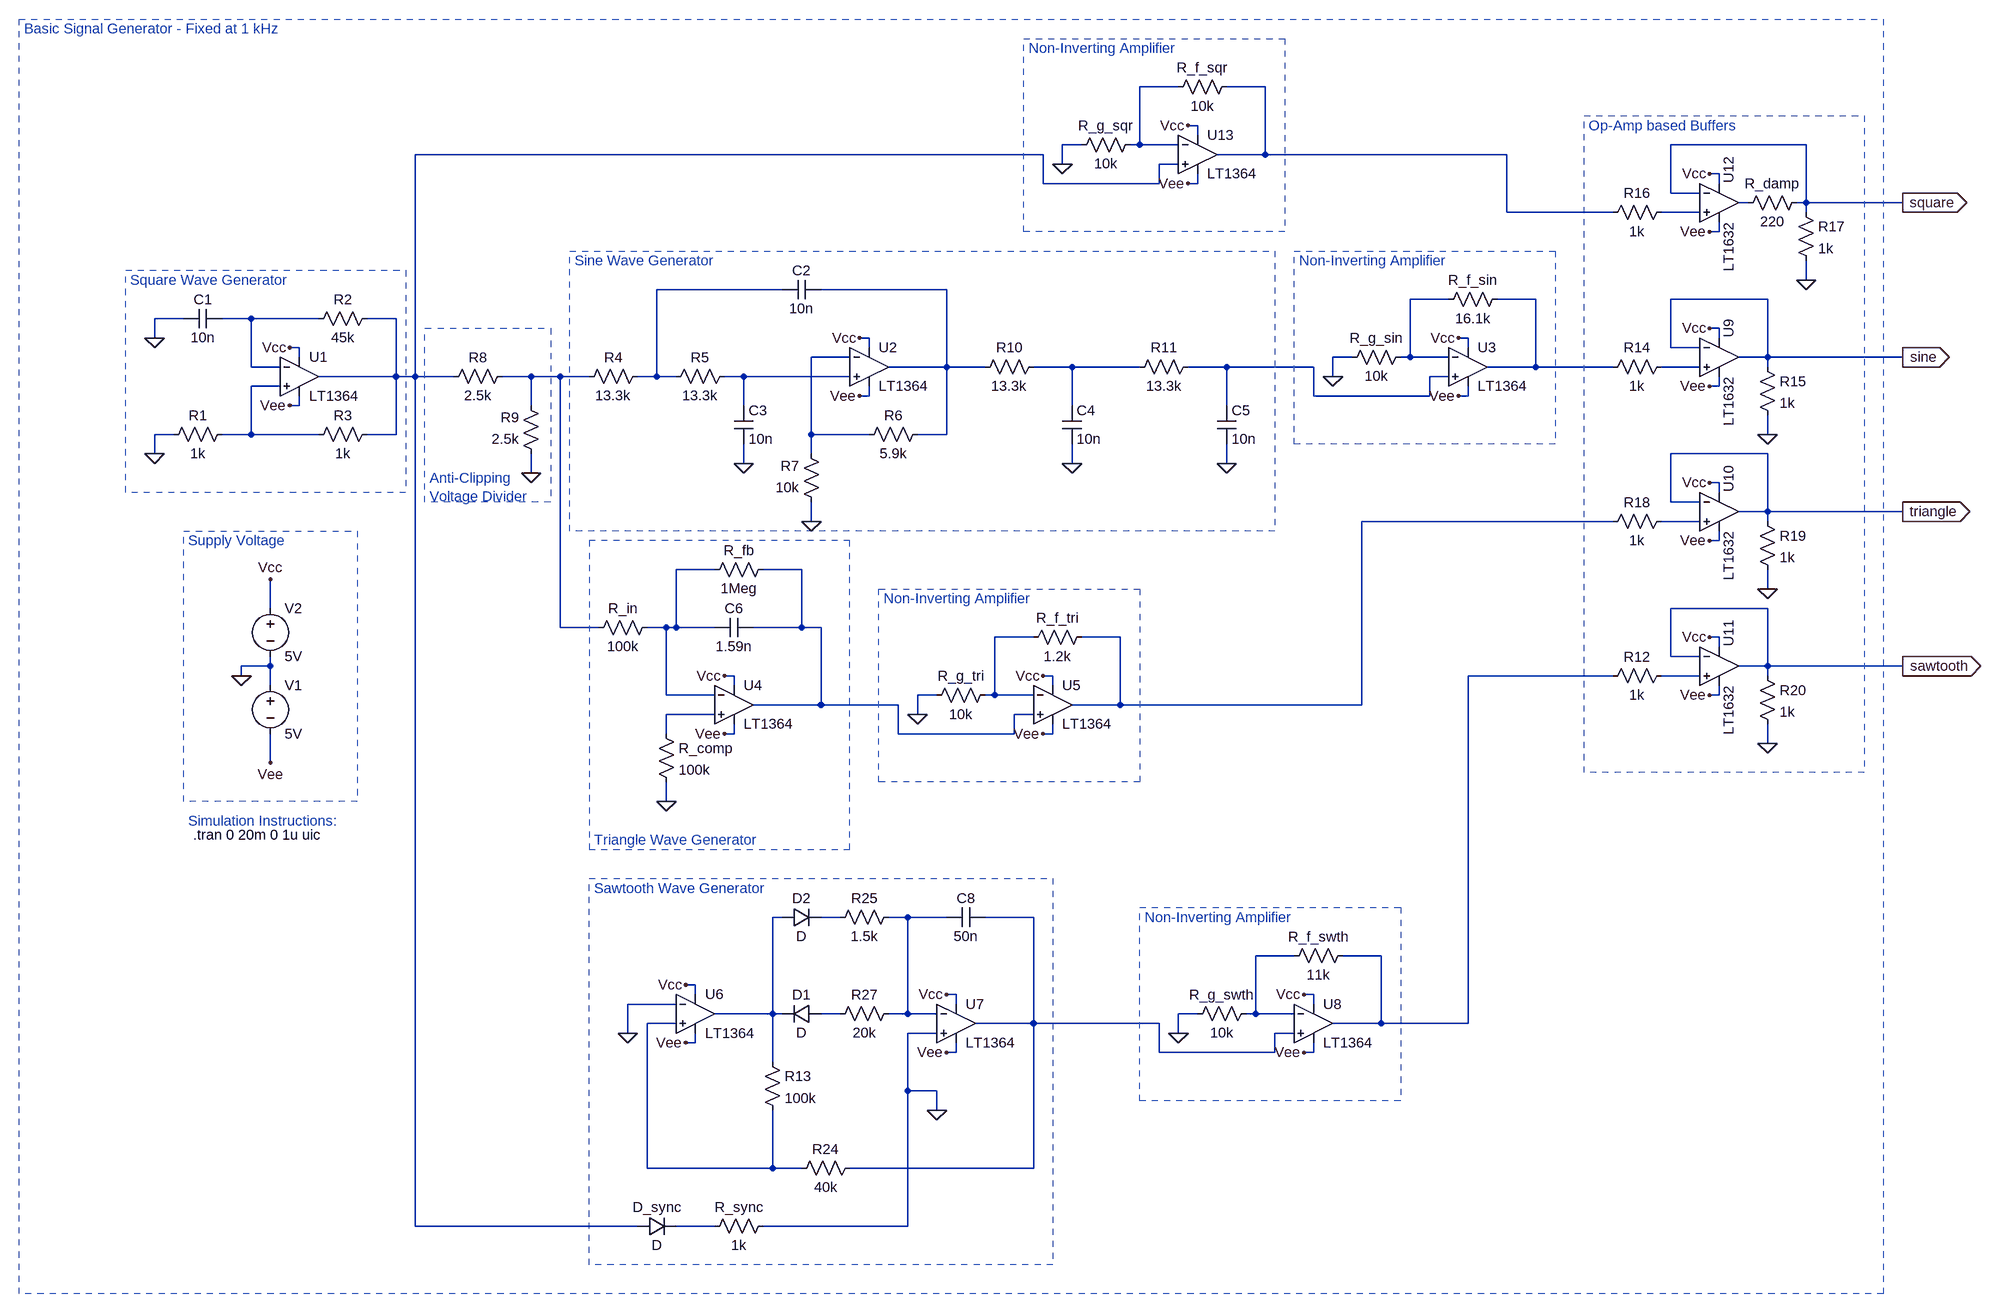
[diagram p0: schematic multi-wave-osc-lt1364.asc]
multi-wave-osc-lt1364.asc, the LTspice schematic file:
Version 4
SHEET 1 3052 2516
WIRE 1632 -176 1568 -176
WIRE 1776 -176 1712 -176
WIRE 1664 -112 1648 -112
WIRE 1664 -96 1664 -112
WIRE 1472 -80 1440 -80
WIRE 1568 -80 1568 -176
WIRE 1568 -80 1552 -80
WIRE 1632 -80 1568 -80
WIRE 2672 -80 2448 -80
WIRE 1408 -64 368 -64
WIRE 1776 -64 1776 -176
WIRE 1776 -64 1696 -64
WIRE 2176 -64 1776 -64
WIRE 1440 -48 1440 -80
WIRE 1632 -48 1600 -48
WIRE 2528 -32 2512 -32
WIRE 1408 -16 1408 -64
WIRE 1600 -16 1600 -48
WIRE 1600 -16 1408 -16
WIRE 1664 -16 1664 -32
WIRE 1664 -16 1648 -16
WIRE 2528 -16 2528 -32
WIRE 2448 0 2448 -80
WIRE 2496 0 2448 0
WIRE 2576 16 2560 16
WIRE 2672 16 2672 -80
WIRE 2672 16 2656 16
WIRE 2832 16 2672 16
WIRE 2176 32 2176 -64
WIRE 2352 32 2176 32
WIRE 2496 32 2432 32
WIRE 2672 32 2672 16
WIRE 2528 64 2528 48
WIRE 2528 64 2512 64
WIRE 2672 144 2672 112
WIRE 976 160 768 160
WIRE 1248 160 1040 160
WIRE 2080 176 2016 176
WIRE 2224 176 2160 176
WIRE 2608 176 2448 176
WIRE -16 208 -64 208
WIRE 96 208 48 208
WIRE 208 208 96 208
WIRE 336 208 288 208
WIRE 2528 224 2512 224
WIRE -64 240 -64 208
WIRE 1120 240 1104 240
WIRE 2112 240 2096 240
WIRE 2528 240 2528 224
WIRE 176 256 160 256
WIRE 1120 256 1120 240
WIRE 2112 256 2112 240
WIRE 2448 256 2448 176
WIRE 2496 256 2448 256
WIRE 176 272 176 256
WIRE 1088 272 1024 272
WIRE 1920 272 1888 272
WIRE 2016 272 2016 176
WIRE 2016 272 2000 272
WIRE 2080 272 2016 272
WIRE 2608 272 2608 176
WIRE 2608 272 2560 272
WIRE 2832 272 2608 272
WIRE 96 288 96 208
WIRE 144 288 96 288
WIRE 1248 288 1248 160
WIRE 1248 288 1152 288
WIRE 1312 288 1248 288
WIRE 1456 288 1392 288
WIRE 1568 288 1456 288
WIRE 1712 288 1648 288
WIRE 1856 288 1712 288
WIRE 2224 288 2224 176
WIRE 2224 288 2144 288
WIRE 2352 288 2224 288
WIRE 2496 288 2432 288
WIRE 2608 288 2608 272
WIRE 336 304 336 208
WIRE 336 304 208 304
WIRE 368 304 368 -64
WIRE 368 304 336 304
WIRE 432 304 368 304
WIRE 560 304 512 304
WIRE 608 304 560 304
WIRE 656 304 608 304
WIRE 768 304 768 160
WIRE 768 304 736 304
WIRE 800 304 768 304
WIRE 912 304 880 304
WIRE 1088 304 912 304
WIRE 1888 304 1888 272
WIRE 2080 304 2048 304
WIRE 144 320 96 320
WIRE 2528 320 2528 304
WIRE 2528 320 2512 320
WIRE 1120 336 1120 320
WIRE 1120 336 1104 336
WIRE 1856 336 1856 288
WIRE 2048 336 2048 304
WIRE 2048 336 1856 336
WIRE 2112 336 2112 320
WIRE 2112 336 2096 336
WIRE 176 352 176 336
WIRE 176 352 160 352
WIRE 560 352 560 304
WIRE 912 352 912 304
WIRE 1456 352 1456 288
WIRE 1712 352 1712 288
WIRE -32 400 -64 400
WIRE 96 400 96 320
WIRE 96 400 48 400
WIRE 208 400 96 400
WIRE 336 400 336 304
WIRE 336 400 288 400
WIRE 1024 400 1024 272
WIRE 1120 400 1024 400
WIRE 1248 400 1248 288
WIRE 1248 400 1200 400
WIRE 2608 400 2608 368
WIRE -64 432 -64 400
WIRE 1024 432 1024 400
WIRE 2608 432 2448 432
WIRE 912 448 912 416
WIRE 1456 448 1456 416
WIRE 1712 448 1712 416
WIRE 560 464 560 432
WIRE 2528 480 2512 480
WIRE 2528 496 2528 480
WIRE 2448 512 2448 432
WIRE 2496 512 2448 512
WIRE 2608 528 2608 432
WIRE 2608 528 2560 528
WIRE 2832 528 2608 528
WIRE 1024 544 1024 512
WIRE 2352 544 1936 544
WIRE 2496 544 2432 544
WIRE 2608 544 2608 528
WIRE 2528 576 2528 560
WIRE 2528 576 2512 576
WIRE 864 624 800 624
WIRE 1008 624 944 624
WIRE 2608 656 2608 624
WIRE 128 688 128 640
WIRE 2608 688 2448 688
WIRE 608 720 608 304
WIRE 672 720 608 720
WIRE 784 720 752 720
WIRE 800 720 800 624
WIRE 800 720 784 720
WIRE 864 720 800 720
WIRE 1008 720 1008 624
WIRE 1008 720 928 720
WIRE 1040 720 1008 720
WIRE 1392 736 1328 736
WIRE 1536 736 1472 736
WIRE 2528 736 2512 736
WIRE 2528 752 2528 736
WIRE 2448 768 2448 688
WIRE 2496 768 2448 768
WIRE 128 784 128 768
WIRE 128 784 80 784
WIRE 2608 784 2608 688
WIRE 2608 784 2560 784
WIRE 2832 784 2608 784
WIRE 80 800 80 784
WIRE 896 800 880 800
WIRE 1424 800 1408 800
WIRE 2352 800 2112 800
WIRE 2496 800 2432 800
WIRE 2608 800 2608 784
WIRE 128 816 128 784
WIRE 896 816 896 800
WIRE 1424 816 1424 800
WIRE 784 832 784 720
WIRE 864 832 784 832
WIRE 1232 832 1200 832
WIRE 1328 832 1328 736
WIRE 1328 832 1312 832
WIRE 1392 832 1328 832
WIRE 2528 832 2528 816
WIRE 2528 832 2512 832
WIRE 1040 848 1040 720
WIRE 1040 848 928 848
WIRE 1168 848 1040 848
WIRE 1536 848 1536 736
WIRE 1536 848 1456 848
WIRE 1936 848 1936 544
WIRE 1936 848 1536 848
WIRE 864 864 784 864
WIRE 1200 864 1200 832
WIRE 1392 864 1360 864
WIRE 784 896 784 864
WIRE 896 896 896 880
WIRE 896 896 880 896
WIRE 1168 896 1168 848
WIRE 1360 896 1360 864
WIRE 1360 896 1168 896
WIRE 1424 896 1424 880
WIRE 1424 896 1408 896
WIRE 2608 912 2608 880
WIRE 128 944 128 896
WIRE 784 1008 784 976
WIRE 976 1200 960 1200
WIRE 1072 1200 1040 1200
WIRE 1184 1200 1152 1200
WIRE 1248 1200 1184 1200
WIRE 1392 1200 1312 1200
WIRE 1824 1264 1760 1264
WIRE 1968 1264 1904 1264
WIRE 832 1312 816 1312
WIRE 832 1328 832 1312
WIRE 1264 1328 1248 1328
WIRE 1856 1328 1840 1328
WIRE 800 1344 720 1344
WIRE 1264 1344 1264 1328
WIRE 1856 1344 1856 1328
WIRE 960 1360 960 1200
WIRE 960 1360 864 1360
WIRE 976 1360 960 1360
WIRE 1072 1360 1040 1360
WIRE 1184 1360 1184 1200
WIRE 1184 1360 1152 1360
WIRE 1232 1360 1184 1360
WIRE 1664 1360 1632 1360
WIRE 1760 1360 1760 1264
WIRE 1760 1360 1744 1360
WIRE 1824 1360 1760 1360
WIRE 800 1376 752 1376
WIRE 1392 1376 1392 1200
WIRE 1392 1376 1296 1376
WIRE 1600 1376 1392 1376
WIRE 1968 1376 1968 1264
WIRE 1968 1376 1888 1376
WIRE 2112 1376 2112 800
WIRE 2112 1376 1968 1376
WIRE 720 1392 720 1344
WIRE 1232 1392 1184 1392
WIRE 1632 1392 1632 1360
WIRE 1824 1392 1792 1392
WIRE 832 1408 832 1392
WIRE 832 1408 816 1408
WIRE 1264 1424 1264 1408
WIRE 1264 1424 1248 1424
WIRE 1600 1424 1600 1376
WIRE 1792 1424 1792 1392
WIRE 1792 1424 1600 1424
WIRE 1856 1424 1856 1408
WIRE 1856 1424 1840 1424
WIRE 960 1440 960 1360
WIRE 1184 1488 1184 1392
WIRE 1232 1488 1184 1488
WIRE 1232 1520 1232 1488
WIRE 752 1616 752 1376
WIRE 960 1616 960 1520
WIRE 960 1616 752 1616
WIRE 1008 1616 960 1616
WIRE 1392 1616 1392 1376
WIRE 1392 1616 1088 1616
WIRE 368 1712 368 304
WIRE 736 1712 368 1712
WIRE 864 1712 800 1712
WIRE 1184 1712 1184 1488
WIRE 1184 1712 944 1712
FLAG -64 240 0
FLAG -64 432 0
FLAG 80 800 0
FLAG 2832 16 square
IOPIN 2832 16 Out
FLAG 128 640 Vcc
FLAG 128 944 Vee
FLAG 160 256 Vcc
FLAG 160 352 Vee
FLAG 1104 240 Vcc
FLAG 1104 336 Vee
FLAG 1024 544 0
FLAG 912 448 0
FLAG 2832 272 sine
IOPIN 2832 272 Out
FLAG 560 464 0
FLAG 1456 448 0
FLAG 1712 448 0
FLAG 2832 528 triangle
IOPIN 2832 528 Out
FLAG 880 800 Vcc
FLAG 880 896 Vee
FLAG 2512 224 Vcc
FLAG 2512 320 Vee
FLAG 2608 400 0
FLAG 2512 -32 Vcc
FLAG 2512 64 Vee
FLAG 2672 144 0
FLAG 2512 480 Vcc
FLAG 2512 576 Vee
FLAG 2608 656 0
FLAG 2096 240 Vcc
FLAG 2096 336 Vee
FLAG 1888 304 0
FLAG 784 1008 0
FLAG 1408 800 Vcc
FLAG 1408 896 Vee
FLAG 1200 864 0
FLAG 816 1312 Vcc
FLAG 816 1408 Vee
FLAG 1248 1328 Vcc
FLAG 1248 1424 Vee
FLAG 2512 736 Vcc
FLAG 2512 832 Vee
FLAG 2608 912 0
FLAG 2832 784 sawtooth
IOPIN 2832 784 Out
FLAG 1840 1328 Vcc
FLAG 1840 1424 Vee
FLAG 1632 1392 0
FLAG 720 1392 0
FLAG 1232 1520 0
FLAG 1648 -112 Vcc
FLAG 1648 -16 Vee
FLAG 1440 -48 0
SYMBOL cap 48 192 R90
WINDOW 0 0 32 VBottom 2
WINDOW 3 32 32 VTop 2
SYMATTR InstName C1
SYMATTR Value 10n
SYMBOL res 64 384 R90
WINDOW 0 0 56 VBottom 2
WINDOW 3 32 56 VTop 2
SYMATTR InstName R1
SYMATTR Value 1k
SYMBOL res 304 192 R90
WINDOW 0 0 56 VBottom 2
WINDOW 3 32 56 VTop 2
SYMATTR InstName R2
SYMATTR Value 45k
SYMBOL res 304 384 R90
WINDOW 0 0 56 VBottom 2
WINDOW 3 32 56 VTop 2
SYMATTR InstName R3
SYMATTR Value 1k
SYMBOL voltage 128 800 R0
WINDOW 123 0 0 Left 0
WINDOW 39 0 0 Left 0
SYMATTR InstName V1
SYMATTR Value 5V
SYMBOL voltage 128 672 R0
WINDOW 123 0 0 Left 0
WINDOW 39 0 0 Left 0
SYMATTR InstName V2
SYMATTR Value 5V
SYMBOL res 1216 384 R90
WINDOW 0 0 56 VBottom 2
WINDOW 3 32 56 VTop 2
SYMATTR InstName R6
SYMATTR Value 5.9k
SYMBOL res 1040 528 R180
WINDOW 0 36 76 Left 2
WINDOW 3 36 40 Left 2
SYMATTR InstName R7
SYMATTR Value 10k
SYMBOL cap 1040 144 R90
WINDOW 0 0 32 VBottom 2
WINDOW 3 32 32 VTop 2
SYMATTR InstName C2
SYMATTR Value 10n
SYMBOL cap 896 352 R0
SYMATTR InstName C3
SYMATTR Value 10n
SYMBOL res 896 288 R90
WINDOW 0 0 56 VBottom 2
WINDOW 3 32 56 VTop 2
SYMATTR InstName R5
SYMATTR Value 13.3k
SYMBOL res 752 288 R90
WINDOW 0 0 56 VBottom 2
WINDOW 3 32 56 VTop 2
SYMATTR InstName R4
SYMATTR Value 13.3k
SYMBOL res 528 288 R90
WINDOW 0 0 56 VBottom 2
WINDOW 3 32 56 VTop 2
SYMATTR InstName R8
SYMATTR Value 2.5k
SYMBOL res 576 448 R180
WINDOW 0 36 76 Left 2
WINDOW 3 36 40 Left 2
SYMATTR InstName R9
SYMATTR Value 2.5k
SYMBOL res 1408 272 R90
WINDOW 0 0 56 VBottom 2
WINDOW 3 32 56 VTop 2
SYMATTR InstName R10
SYMATTR Value 13.3k
SYMBOL cap 1440 352 R0
SYMATTR InstName C4
SYMATTR Value 10n
SYMBOL res 1664 272 R90
WINDOW 0 0 56 VBottom 2
WINDOW 3 32 56 VTop 2
SYMATTR InstName R11
SYMATTR Value 13.3k
SYMBOL cap 1696 352 R0
SYMATTR InstName C5
SYMATTR Value 10n
SYMBOL res 768 704 R90
WINDOW 0 0 56 VBottom 2
WINDOW 3 32 56 VTop 2
SYMATTR InstName R_in
SYMATTR Value 100k
SYMBOL cap 928 704 R90
WINDOW 0 0 32 VBottom 2
WINDOW 3 32 32 VTop 2
SYMATTR InstName C6
SYMATTR Value 1.59n
SYMBOL res 960 608 R90
WINDOW 0 0 56 VBottom 2
WINDOW 3 32 56 VTop 2
SYMATTR InstName R_fb
SYMATTR Value 1Meg
SYMBOL res 2448 272 R90
WINDOW 0 0 56 VBottom 2
WINDOW 3 32 56 VTop 2
SYMATTR InstName R14
SYMATTR Value 1k
SYMBOL res 2592 272 R0
SYMATTR InstName R15
SYMATTR Value 1k
SYMBOL res 2448 16 R90
WINDOW 0 0 56 VBottom 2
WINDOW 3 32 56 VTop 2
SYMATTR InstName R16
SYMATTR Value 1k
SYMBOL res 2656 16 R0
SYMATTR InstName R17
SYMATTR Value 1k
SYMBOL res 2448 528 R90
WINDOW 0 0 56 VBottom 2
WINDOW 3 32 56 VTop 2
SYMATTR InstName R18
SYMATTR Value 1k
SYMBOL res 2592 528 R0
SYMATTR InstName R19
SYMATTR Value 1k
SYMBOL res 2176 160 R90
WINDOW 0 0 56 VBottom 2
WINDOW 3 32 56 VTop 2
SYMATTR InstName R_f_sin
SYMATTR Value 16.1k
SYMBOL res 2016 256 R90
WINDOW 0 0 56 VBottom 2
WINDOW 3 32 56 VTop 2
SYMATTR InstName R_g_sin
SYMATTR Value 10k
SYMBOL res 768 880 R0
SYMATTR InstName R_comp
SYMATTR Value 100k
SYMBOL res 1488 720 R90
WINDOW 0 0 56 VBottom 2
WINDOW 3 32 56 VTop 2
SYMATTR InstName R_f_tri
SYMATTR Value 1.2k
SYMBOL res 1328 816 R90
WINDOW 0 0 56 VBottom 2
WINDOW 3 32 56 VTop 2
SYMATTR InstName R_g_tri
SYMATTR Value 10k
SYMBOL diode 1040 1344 R90
WINDOW 0 0 32 VBottom 2
WINDOW 3 32 32 VTop 2
SYMATTR InstName D1
SYMBOL diode 976 1216 R270
WINDOW 0 32 32 VTop 2
WINDOW 3 0 32 VBottom 2
SYMATTR InstName D2
SYMBOL res 1168 1184 R90
WINDOW 0 0 56 VBottom 2
WINDOW 3 32 56 VTop 2
SYMATTR InstName R25
SYMATTR Value 1.5k
SYMBOL res 1168 1344 R90
WINDOW 0 0 56 VBottom 2
WINDOW 3 32 56 VTop 2
SYMATTR InstName R27
SYMATTR Value 20k
SYMBOL cap 1312 1184 R90
WINDOW 0 0 32 VBottom 2
WINDOW 3 32 32 VTop 2
SYMATTR InstName C8
SYMATTR Value 50n
SYMBOL res 944 1424 R0
SYMATTR InstName R13
SYMATTR Value 100k
SYMBOL res 1104 1600 R90
WINDOW 0 0 56 VBottom 2
WINDOW 3 32 56 VTop 2
SYMATTR InstName R24
SYMATTR Value 40k
SYMBOL res 2448 784 R90
WINDOW 0 0 56 VBottom 2
WINDOW 3 32 56 VTop 2
SYMATTR InstName R12
SYMATTR Value 1k
SYMBOL res 2592 784 R0
SYMATTR InstName R20
SYMATTR Value 1k
SYMBOL res 1920 1248 R90
WINDOW 0 0 56 VBottom 2
WINDOW 3 32 56 VTop 2
SYMATTR InstName R_f_swth
SYMATTR Value 11k
SYMBOL res 1760 1344 R90
WINDOW 0 0 56 VBottom 2
WINDOW 3 32 56 VTop 2
SYMATTR InstName R_g_swth
SYMATTR Value 10k
SYMBOL res 960 1696 R90
WINDOW 0 0 56 VBottom 2
WINDOW 3 32 56 VTop 2
SYMATTR InstName R_sync
SYMATTR Value 1k
SYMBOL diode 736 1728 R270
WINDOW 0 32 32 VTop 2
WINDOW 3 0 32 VBottom 2
SYMATTR InstName D_sync
SYMBOL OpAmps\\LT1364 1120 224 R0
SYMATTR InstName U2
SYMBOL OpAmps\\LT1364 2112 224 R0
SYMATTR InstName U3
SYMBOL OpAmps\\LT1364 896 784 R0
SYMATTR InstName U4
SYMBOL OpAmps\\LT1364 1424 784 R0
SYMATTR InstName U5
SYMBOL OpAmps\\LT1364 832 1296 R0
SYMATTR InstName U6
SYMBOL OpAmps\\LT1364 1264 1312 R0
SYMATTR InstName U7
SYMBOL OpAmps\\LT1364 1856 1312 R0
SYMATTR InstName U8
SYMBOL OpAmps\\LT1364 176 240 R0
SYMATTR InstName U1
SYMBOL res 1728 -192 R90
WINDOW 0 0 56 VBottom 2
WINDOW 3 32 56 VTop 2
SYMATTR InstName R_f_sqr
SYMATTR Value 10k
SYMBOL res 1568 -96 R90
WINDOW 0 0 56 VBottom 2
WINDOW 3 32 56 VTop 2
SYMATTR InstName R_g_sqr
SYMATTR Value 10k
SYMBOL OpAmps\\LT1364 1664 -128 R0
SYMATTR InstName U13
SYMBOL res 2672 0 R90
WINDOW 0 0 56 VBottom 2
WINDOW 3 32 56 VTop 2
SYMATTR InstName R_damp
SYMATTR Value 220
SYMBOL OpAmps\\LT1632 2528 -48 R0
WINDOW 0 16 32 VLeft 2
WINDOW 3 16 96 VRight 2
SYMATTR InstName U12
SYMBOL OpAmps\\LT1632 2528 208 R0
WINDOW 0 16 32 VLeft 2
WINDOW 3 16 96 VRight 2
SYMATTR InstName U9
SYMBOL OpAmps\\LT1632 2528 464 R0
WINDOW 0 16 32 VLeft 2
WINDOW 3 16 96 VRight 2
SYMATTR InstName U10
SYMBOL OpAmps\\LT1632 2528 720 R0
WINDOW 0 16 32 VLeft 2
WINDOW 3 16 96 VRight 2
SYMATTR InstName U11
TEXT 0 1064 Left 2 !.tran 0 20m 0 1u uic
TEXT -104 144 Left 2 ;Square Wave Generator
TEXT 632 112 Left 2 ;Sine Wave Generator
TEXT 664 1072 Left 2 ;Triangle Wave Generator
TEXT 2312 -112 Left 2 ;Op-Amp based Buffers
TEXT 392 472 Left 2 ;Anti-Clipping \nVoltage Divider
TEXT 1832 112 Left 2 ;Non-Inverting Amplifier
TEXT 1144 672 Left 2 ;Non-Inverting Amplifier
TEXT 1576 1200 Left 2 ;Non-Inverting Amplifier
TEXT 664 1152 Left 2 ;Sawtooth Wave Generator
TEXT -280 -272 Left 2 ;Basic Signal Generator - Fixed at 1 kHz
TEXT -8 576 Left 2 ;Supply Voltage
TEXT -8 1040 Left 2 ;Simulation Instructions:
TEXT 1384 -240 Left 2 ;Non-Inverting Amplifier
RECTANGLE Normal 352 496 -112 128 2
RECTANGLE Normal 2256 416 1824 96 2
RECTANGLE Normal 656 1088 1088 576 2
RECTANGLE Normal 1568 976 1136 656 2
RECTANGLE Normal 2768 960 2304 -128 2
RECTANGLE Normal 2000 1504 1568 1184 2
RECTANGLE Normal 272 1008 -16 560 2
RECTANGLE Normal 1792 560 624 96 2
RECTANGLE Normal 592 512 384 224 2
RECTANGLE Normal 1424 1776 656 1136 2
RECTANGLE Normal 1808 64 1376 -256 2
RECTANGLE Normal 2800 1824 -288 -288 2

The netlist it stands for:
* multi-wave-osc-lt1364.asc
C1 N010 0 10n
R1 N017 0 1k
R2 N003 N010 45k
R3 N003 N017 1k
V1 0 Vee 5V
V2 Vcc 0 5V
R6 N007 N011 5.9k
R7 0 N011 10k
C2 N007 N006 10n
C3 N016 0 10n
R5 N016 N006 13.3k
R4 N006 N015 13.3k
R8 N015 N003 2.5k
R9 0 N015 2.5k
R10 N012 N007 13.3k
C4 N012 0 10n
R11 N013 N012 13.3k
C5 N013 0 10n
R_in N020 N015 100k
C6 N021 N020 1.59n
R_fb N021 N020 1Meg
R14 N014 N009 1k
R15 sine 0 1k
R16 N005 N002 1k
R17 square 0 1k
R18 N019 N018 1k
R19 triangle 0 1k
R_f_sin N009 N008 16.1k
R_g_sin N008 0 10k
R_comp N025 0 100k
R_f_tri N018 N022 1.2k
R_g_tri N022 0 10k
D1 N031 N026 D
D2 N026 N027 D
R25 N028 N027 1.5k
R27 N028 N031 20k
C8 N029 N028 50n
R13 N026 N032 100k
R24 N029 N032 40k
R12 N024 N023 1k
R20 sawtooth 0 1k
R_f_swth N023 N030 11k
R_g_swth N030 0 10k
R_sync 0 N033 1k
D_sync N003 N033 D
XU2 N016 N011 Vcc Vee N007 LT1363  ; LT1364, pins In+ In- V+ V- OUT
XU3 N013 N008 Vcc Vee N009 LT1363  ; LT1364, pins In+ In- V+ V- OUT
XU4 N025 N020 Vcc Vee N021 LT1363  ; LT1364, pins In+ In- V+ V- OUT
XU5 N021 N022 Vcc Vee N018 LT1363  ; LT1364, pins In+ In- V+ V- OUT
XU6 N032 0 Vcc Vee N026 LT1363  ; LT1364, pins In+ In- V+ V- OUT
XU7 0 N028 Vcc Vee N029 LT1363  ; LT1364, pins In+ In- V+ V- OUT
XU8 N029 N030 Vcc Vee N023 LT1363  ; LT1364, pins In+ In- V+ V- OUT
XU1 N017 N010 Vcc Vee N003 LT1363  ; LT1364, pins In+ In- V+ V- OUT
R_f_sqr N002 N001 10k
R_g_sqr N001 0 10k
XU13 N003 N001 Vcc Vee N002 LT1363  ; LT1364, pins In+ In- V+ V- OUT
R_damp square N004 220
XU12 N005 square Vcc Vee N004 LT1632  ; pins In+ In- V+ V- OUT
XU9 N014 sine Vcc Vee sine LT1632  ; pins In+ In- V+ V- OUT
XU10 N019 triangle Vcc Vee triangle LT1632  ; pins In+ In- V+ V- OUT
XU11 N024 sawtooth Vcc Vee sawtooth LT1632  ; pins In+ In- V+ V- OUT
.model D D
.lib standard.dio
.tran 0 20m 0 1u uic
* Square Wave Generator
* Sine Wave Generator
* Triangle Wave Generator
* Op-Amp based Buffers
* Anti-Clipping
* Voltage Divider
* Non-Inverting Amplifier
* Non-Inverting Amplifier
* Non-Inverting Amplifier
* Sawtooth Wave Generator
* Basic Signal Generator - Fixed at 1 kHz
* Supply Voltage
* Simulation Instructions:
* Non-Inverting Amplifier
.lib LTC.lib
.backanno
.end